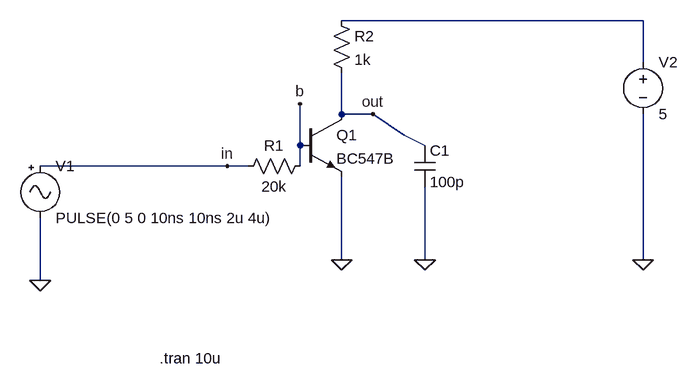
[diagram p0: schematic 3.1.asc]
3.1.asc, the LTspice schematic file:
Version 4
SHEET 1 880 680
WIRE 752 -112 288 -112
WIRE 752 -48 752 -112
WIRE 288 32 288 -32
WIRE 336 32 288 32
WIRE 384 64 336 32
WIRE 224 80 224 16
WIRE 416 80 384 64
WIRE 112 112 -176 112
WIRE 144 112 112 112
WIRE 224 112 224 80
WIRE 288 256 288 128
WIRE 416 256 416 144
WIRE 752 256 752 32
WIRE -176 288 -176 192
FLAG -176 288 0
FLAG 288 256 0
FLAG 416 256 0
FLAG 752 256 0
FLAG 112 112 in
FLAG 336 32 out
FLAG 224 16 b
SYMBOL Misc\\signal -176 96 R0
WINDOW 123 0 0 Left 2
WINDOW 39 0 0 Left 2
SYMATTR InstName V1
SYMATTR Value PULSE(0 5 0 10ns 10ns 2u 4u)
SYMBOL res 240 96 R90
WINDOW 0 0 56 VBottom 2
WINDOW 3 32 56 VTop 2
SYMATTR InstName R1
SYMATTR Value 20k
SYMBOL res 272 -128 R0
SYMATTR InstName R2
SYMATTR Value 1k
SYMBOL voltage 752 -64 R0
WINDOW 123 0 0 Left 2
WINDOW 39 0 0 Left 2
SYMATTR InstName V2
SYMATTR Value 5
SYMBOL cap 400 80 R0
SYMATTR InstName C1
SYMATTR Value 100p
SYMBOL npn 224 32 R0
SYMATTR InstName Q1
SYMATTR Value BC547B
TEXT 8 408 Left 2 !.tran 10u

The netlist it stands for:
* 3.1.asc
V1 in 0 PULSE(0 5 0 10ns 10ns 2u 4u)
R1 b in 20k
R2 N001 out 1k
V2 N001 0 5
C1 out 0 100p
Q1 out b 0 0 BC547B
.model NPN NPN
.model PNP PNP
.lib standard.bjt
.tran 10u
.backanno
.end